# Altium project ltc1420_adc.PrjPcb
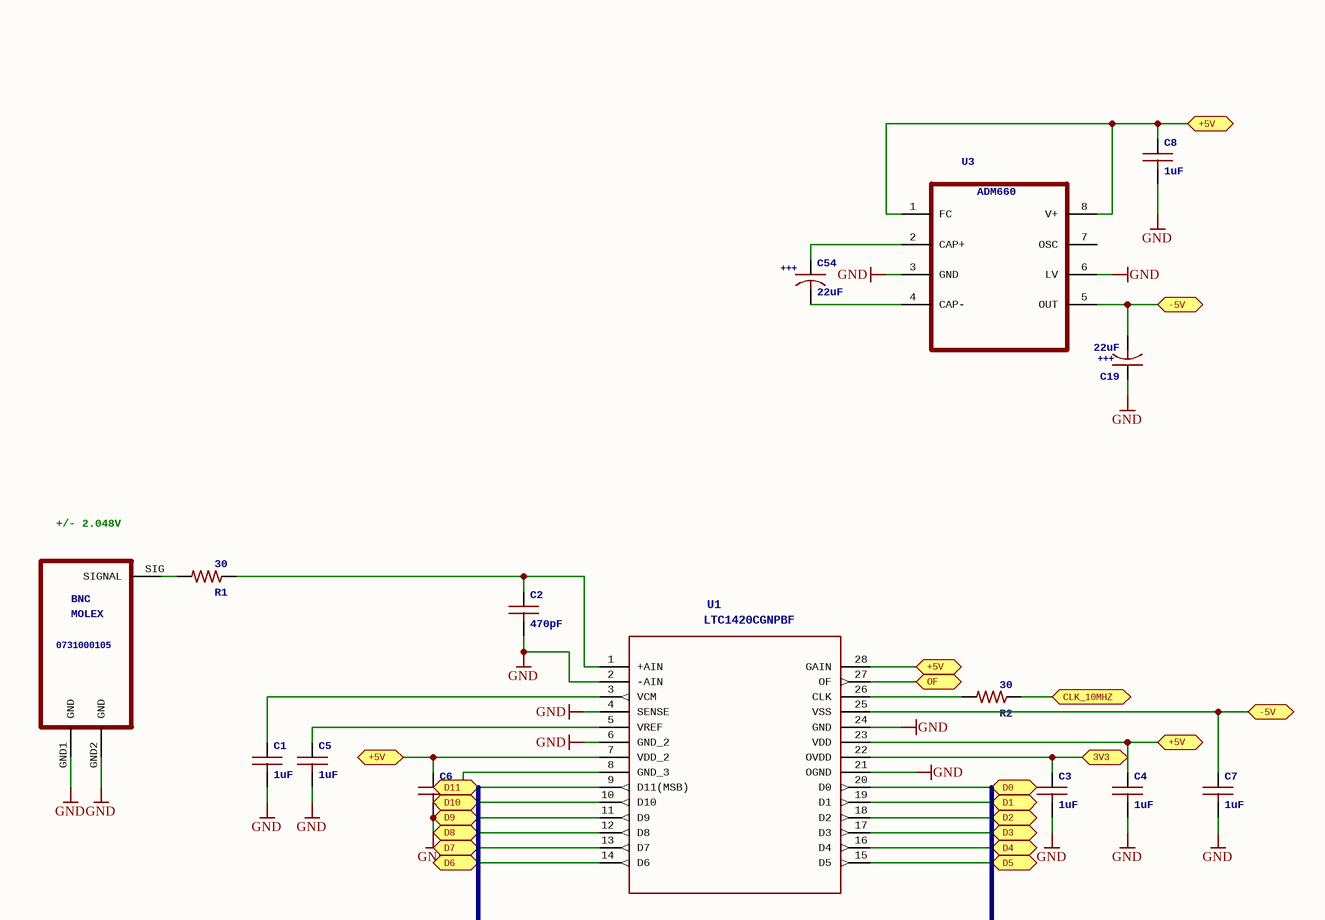
[diagram p0: ltc1420_adc.SchDoc, top left]
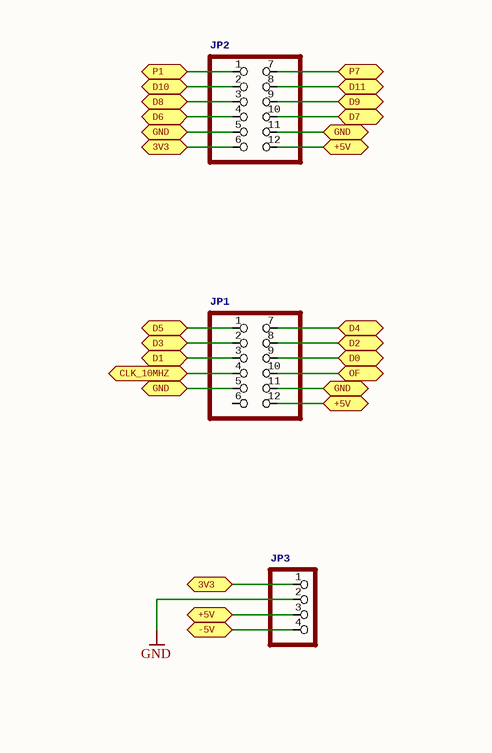
[diagram p1: ltc1420_adc.SchDoc, top right]
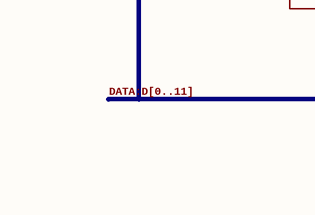
[diagram p2: ltc1420_adc.SchDoc, bottom left]
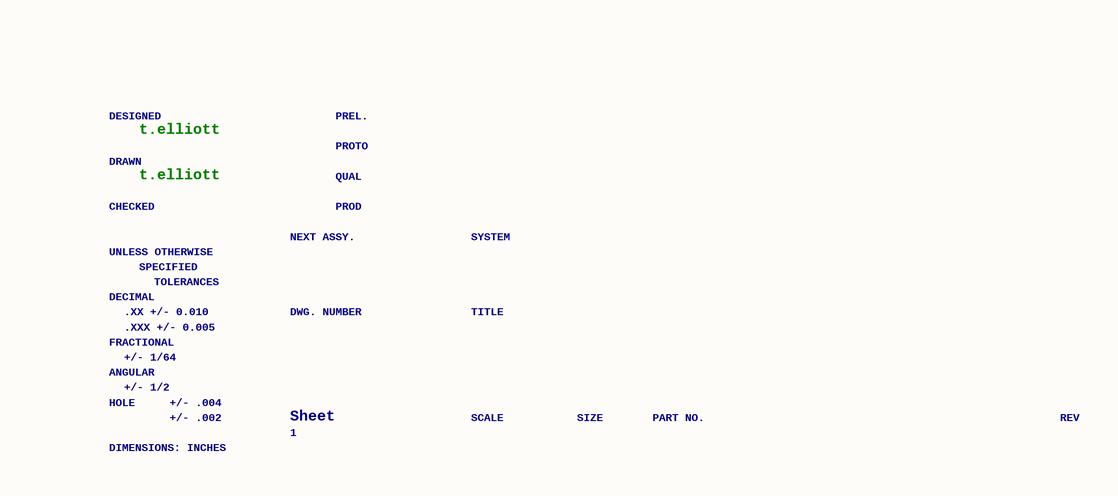
[diagram p3: ltc1420_adc.SchDoc, bottom right]
1 sheet, 18 parts. Net scope: flat (ports and power ports of the same name join across sheets).
Board file: ltc1420_adc.PcbDoc

## Sheet ltc1420_adc.SchDoc
size 576 x 416 mm; SheetNumber: 1

### Parts
C1  1uF  [C0603]
C2  470pF  [C0603]
C3  1uF  [C0603]
C4  1uF  [C0603]
C5  1uF  [C0603]
C6  1uF  [C0603]
C7  1uF  [C0603]
C8  1uF  [C0603]
C19  22uF  [1210K]
C54  22uF  [1210K]
J1  0731000105_MOLEX_BNC  [BNC]  (value not drawn)
JP1  PINHD-2X6  [2X06]  (value not drawn)
JP2  PINHD-2X6  [2X06]  (value not drawn)
JP3  PINHD-1X4  [1X04]  (value not drawn)
R1  30  [R0402]
R2  30  [R0402]
U1  LTC1420CGNPBF  [SSOP-28_GN]
U3  ADM660  [SO8]

### Ports
3V3, +5V, -5V, CLK_10MHZ, D0, D1, D2, D3, D4, D5, D6, D7, D8, D9, D10, D11, GND, OF, P1, P7

### Nets
GND: C1.2 C2.2 C3.2 C4.2 C5.2 C6.2 C7.2 C8.2 C19.A J1.GND1(GND) J1.GND2(GND) JP2.3 JP2.9 JP3.2 U1.2(-AIN) U1.4(SENSE) U1.6(GND_2) U1.8(GND_3) U1.11(D9) U1.12(D8) U1.21(OGND) U1.24(GND) U3.3(GND) U3.6(LV) ; port D8, port D9
NetC1_1: C1.1 U1.3(VCM)
NetC2_1: C2.1 R1.1 U1.1(+AIN)
NetC3_1: C3.1 C4.1 C6.1 C8.1 JP1.12 JP2.6 JP2.12 JP3.1 JP3.3 U1.7(VDD_2) U1.22(OVDD) U1.23(VDD) U1.28(GAIN) U3.1(FC) U3.8(V+) ; port 3V3, port +5V
NetC5_1: C5.1 U1.5(VREF)
NetC7_1: C7.1 C19.C JP3.4 U1.25(VSS) U3.5(OUT) ; port -5V
NetC54_A: C54.A U3.2(CAP+)
NetC54_C: C54.C U3.4(CAP-)
NetJ1_SIG: J1.SIG(SIGNAL) R1.2
NetJP1_1: JP1.1 U1.15(D5) ; port D5
NetJP1_2: JP1.2 U1.17(D3) ; port D3
NetJP1_3: JP1.3 U1.19(D1) ; port D1
NetJP1_4: JP1.4 R2.1 ; port CLK_10MHZ
NetJP1_5: JP1.5 JP1.11 JP2.5 JP2.11 ; port GND
NetJP1_7: JP1.7 U1.16(D4) ; port D4
NetJP1_8: JP1.8 U1.18(D2) ; port D2
NetJP1_9: JP1.9 U1.20(D0) ; port D0
NetJP1_10: JP1.10 U1.27(OF) ; port OF
NetJP2_1: JP2.1 ; port P1
NetJP2_2: JP2.2 U1.10(D10) ; port D10
NetJP2_4: JP2.4 U1.14(D6) ; port D6
NetJP2_7: JP2.7 ; port P7
NetJP2_8: JP2.8 U1.9(D11(MSB)) ; port D11
NetJP2_10: JP2.10 U1.13(D7) ; port D7
NetR2_2: R2.2 U1.26(CLK)

Not connected (* = marked no-connect by the designer): JP1 6(11); U3 7(OSC)

### Buses and harness runs
bus DATA:D[0..11]

### Notes on the sheet
- (near J1) +/- 2.048V
- DESIGNED
- t.elliott
- PREL.
- PROTO
- DRAWN
- CHECKED
- QUAL
- PROD
- UNLESS OTHERWISE
- DECIMAL
- SPECIFIED
- TOLERANCES
- NEXT ASSY.
- SYSTEM
- FRACTIONAL
- ANGULAR
- .XX +/- 0.010
- .XXX +/- 0.005
- +/- 1/64
- DWG. NUMBER
- TITLE
- HOLE
- DIMENSIONS: INCHES
- +/- 1/2
- +/- .004
- +/- .002
- Sheet
- 1
- SCALE
- SIZE
- PART NO.
- REV

### Library data of the parts
C1-C8 = C-USC0603: CAPACITOR, American symbol
C19 C54 = CAPACITOR1210K: +++: +++
JP1 JP2 = PINHD-2X6: PIN HEADER
JP3 = PINHD-1X4: PIN HEADER
R1 R2 = R-US_R0402: RESISTOR, American symbol
U1 = LTC1420CGNPBF: MANUFACTURER_PART_NUMBER: ltc1420cgn#pbf; VENDOR: Linear Technology
J1 = 0731000105_MOLEX_BNC: BNC: BNC; MOLEX: MOLEX; 0731000105: 0731000105
U3 = ADM660: ADM660: ADM660